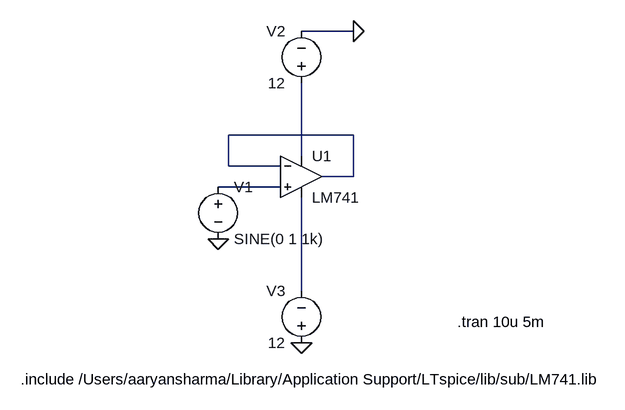
[diagram p0: schematic Voltage Follower.asc]
Voltage Follower.asc, the LTspice schematic file:
Version 4
SHEET 1 904 680
WIRE 496 96 416 96
WIRE 496 256 304 256
WIRE 416 288 416 176
WIRE 304 304 304 256
WIRE 384 304 304 304
WIRE 496 320 496 256
WIRE 496 320 448 320
WIRE 384 336 288 336
WIRE 416 496 416 352
FLAG 288 416 0
FLAG 416 576 0
FLAG 496 96 0
SYMBOL OpAmps/opamp2 416 256 R0
SYMATTR InstName U1
SYMATTR Value LM741
SYMBOL voltage 288 320 R0
SYMATTR InstName V1
SYMATTR Value SINE(0 1 1k)
SYMBOL voltage 416 192 R180
WINDOW 0 24 96 Left 2
WINDOW 3 24 16 Left 2
SYMATTR InstName V2
SYMATTR Value 12
SYMBOL voltage 416 592 R180
WINDOW 0 24 96 Left 2
WINDOW 3 24 16 Left 2
SYMATTR InstName V3
SYMATTR Value 12
TEXT -16 632 Left 2 !.include /Users/aaryansharma/Library/Application Support/LTspice/lib/sub/LM741.lib
TEXT 656 544 Left 2 !.tran 10u 5m

The netlist it stands for:
* Voltage Follower.asc
XU1 N003 N001 N002 N004 N001 LM741  ; pins In+ In- V+ V- OUT
V1 N003 0 SINE(0 1 1k)
V2 N002 0 12
V3 0 N004 12
.include /Users/aaryansharma/Library/Application Support/LTspice/lib/sub/LM741.lib
.tran 10u 5m
.backanno
.end